# EAGLE design C64_Keyb-Test (EAGLE 9.5.2)
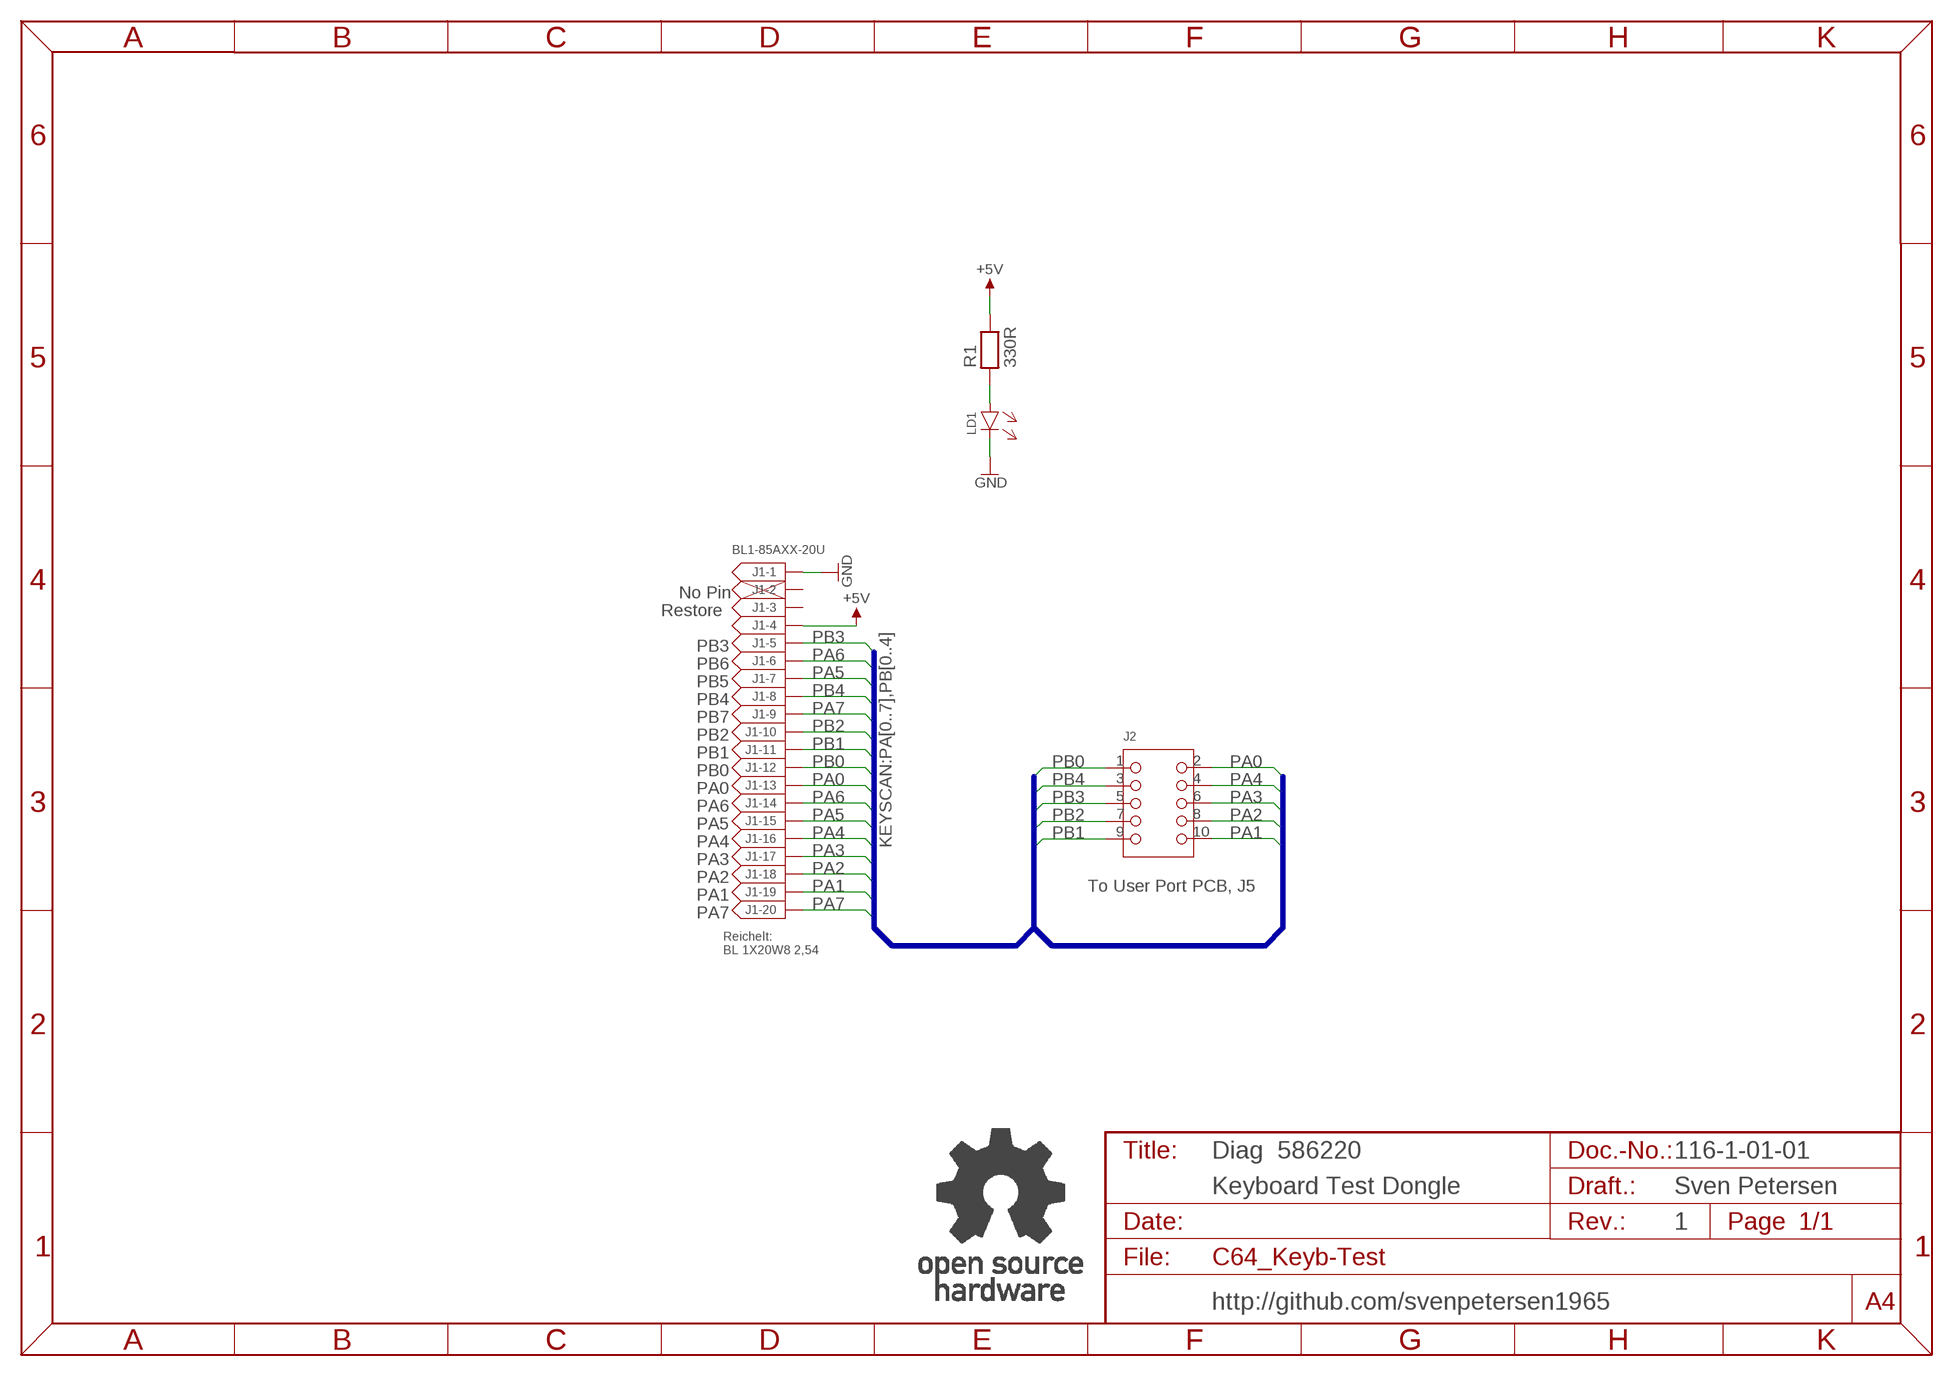
[diagram p0: schematic, sheet 1]

## Parts
J1  BL1-85AXX-20U  [BL1-85AXX-20U]
J2  2X05WV  [2X05WV]
LD1  3MM  [3MM]
R1  330R  RES04  [R-10]
U$9  OPEN_SOURCE_HW  [OPENHW]

## Nets
+5V: J1.4 R1.2
GND: J1.1 LD1.C(K)
N$1: LD1.A R1.1
PA0: J1.13 J2.2
PA1: J1.19 J2.10
PA2: J1.18 J2.8
PA3: J1.17 J2.6
PA4: J1.16 J2.4
PA5: J1.7 J1.15
PA6: J1.6 J1.14
PA7: J1.9 J1.20
PB0: J1.12 J2.1
PB1: J1.11 J2.9
PB2: J1.10 J2.7
PB3: J1.5 J2.5
PB4: J1.8 J2.3
Unconnected: J1.2 J1.3

## Buses
KEYSCAN:PA[0..7],PB[0..4]

## Notes on the sheet
- No Pin
- Restore
- PB3
- PB6
- PB5
- PB4
- PB7
- PB2
- PB1
- PB0
- PA0
- PA6
- PA5
- PA4
- PA3
- PA2
- To User Port PCB, J5
- PA1
- PA7
- Reichelt:
  BL 1X20W8 2,54
- Diag  586220 | 116-1-01-01
- Keyboard Test Dongle | Sven Petersen
- 1
- http://github.com/svenpetersen1965

## Library data of the parts
J1 = MPE_Garry:BL1-85AXX-20U
J2 = PINHEAD:2X05WV
LD1 = LED:3MM
R1 = DISCRETE:RES04
U$9 = Logo:OPEN_SOURCE_HW

## Board
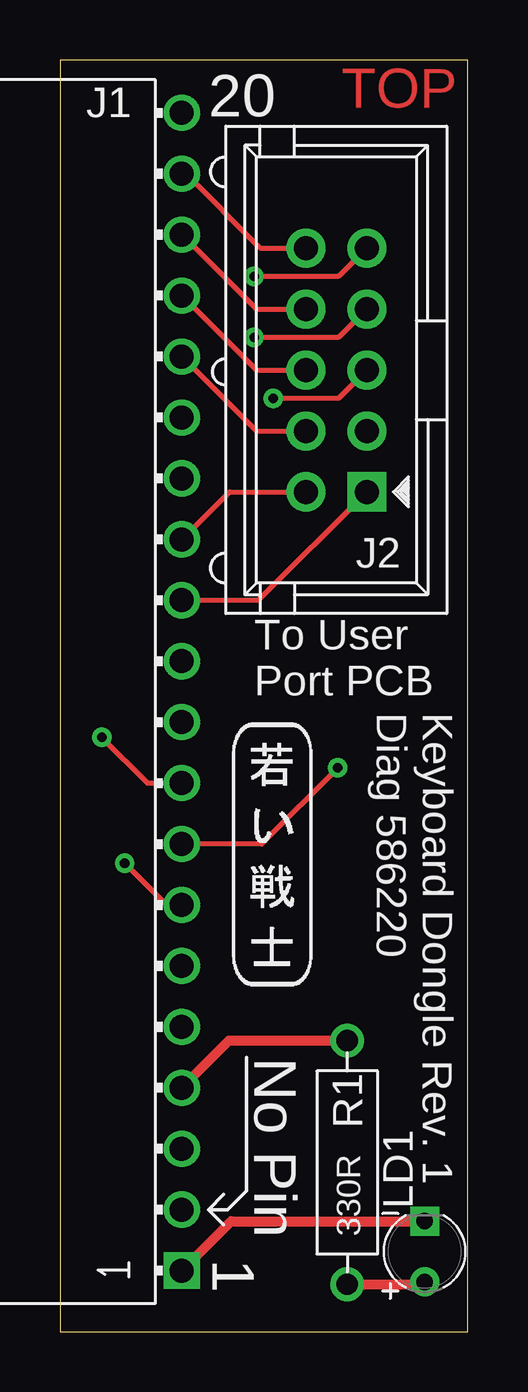
[diagram p1: board, top side]
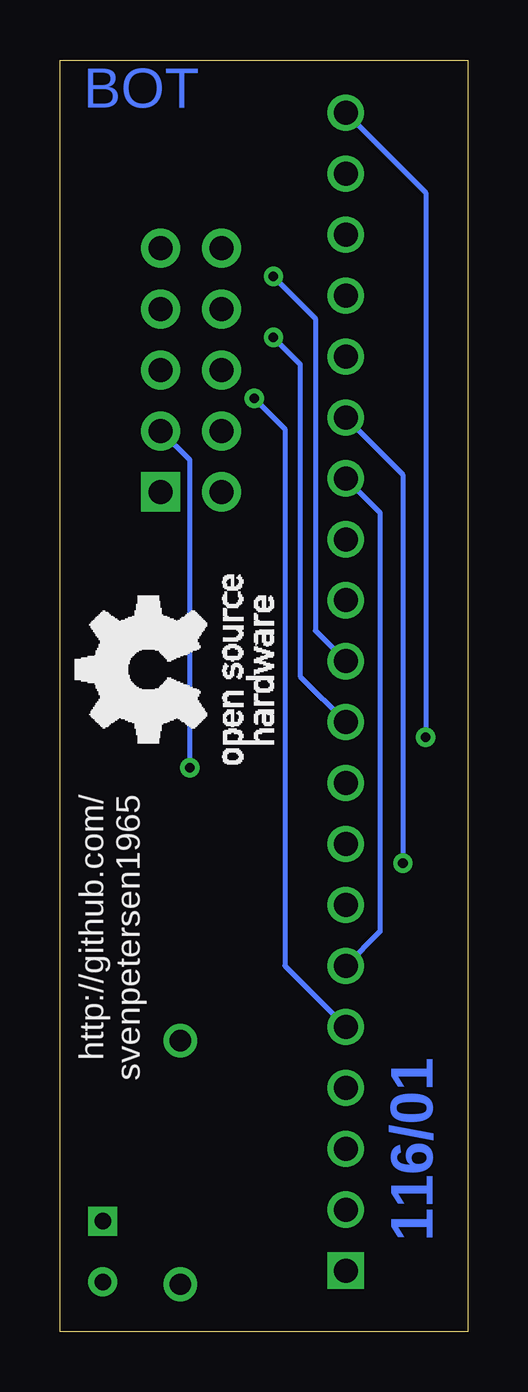
[diagram p2: board, bottom side, seen from below]

Size 17 x 53 mm. Coordinates in mm from the lower left corner, seen from the top.
Outline: 0,0 17,0 17,53 0,53 0,0
Copper layers (1*16): Top 0.035mm / dielectric 1.5mm / Bottom 0.035mm
Design rules "default *": minimum track width 6mil, minimum drill 0.35mm, track to track 6mil, track to pad 6mil, pad to pad 6mil, via to via 6mil, smd to smd 6mil, copper to edge 40mil, drill to drill 6mil, minimum pad ring 10mil, minimum via ring 8mil, stop-mask expansion 4mil, vias tented up to drill 24mil, thermal gap 10mil

### Footprints (pad centres in the part's own frame; a part is rotated, then mirrored left to right if it is on the bottom)
BL1-85AXX-20U = drill 1 square: 1 -24.13,0 | drill 1: 2 -21.59,0; 3 -19.05,0; 4 -16.51,0; 5 -13.97,0; 6 -11.43,0; 7 -8.89,0; 8 -6.35,0; 9 -3.81,0; 10 -1.27,0; 11 1.27,0; 12 3.81,0; 13 6.35,0; 14 8.89,0; 15 11.43,0; 16 13.97,0; 17 16.51,0; 18 19.05,0; 19 21.59,0; 20 24.13,0
2X05WV = drill 1 pad 1.626 square: 1 -5.08,-1.27 | drill 1 pad 1.626: 2 -5.08,1.27; 3 -2.54,-1.27; 4 -2.54,1.27; 5 0,-1.27; 6 0,1.27; 7 2.54,-1.27; 8 2.54,1.27; 9 5.08,-1.27; 10 5.08,1.27
3MM = drill 0.7: A -1.27,0 | drill 0.7 square: C 1.27,0
R-10 = drill 0.889 pad 1.397: 1 -5.08,0; 2 5.08,0

### Placement (x,y rotation side)
J1  5.08,26.67 90 top
J2  11.53,40.08 90 top
LD1  15.21,3.33 90 top
R1  11.98,7.05 90 top
U$6  [2LAYER]  11.73,51.01 0 top
U$7  [PCB-TITLE/]  0,60 0 top  (outside the outline)
U$8  [SVEN_TAG]  8.89,20 0 top
U$9  8.1,23.65 90 bottom

### Tracks (layer width: path | path; a pad name or v marks a point on that pad's centre or on a via)
+5V
  Top 0.406: J1.4 7.05,12.13 R1.2
GND
  Top 0.406: J1.1 7.14,4.6 LD1.C
N$1
  Top 0.406: R1.1 15.11,1.97 LD1.A
PA0
  Top 0.203: J1.13 5.1,33.02 7.08,35 J2.2
PA1
  Top 0.203: J1.19 5.25,48.26 8.35,45.16 J2.10
PA2
  Top 0.203: J1.18 8.19,42.62 J2.8
PA3
  Top 0.203: J1.17 8.19,40.08 J2.6
PA4
  Top 0.203: J1.16 8.19,37.54 J2.4
PA5  (via drill 0.4)
  Top 0.203: v2.7,19.53 4.45,17.78 J1.7
  Bottom 0.203: J1.15 2.7,35.72 v2.7,19.53
PA6
  Bottom 0.203: J1.14 3.65,34.13 3.65,16.67 J1.6
PA7  (via drill 0.4)
  Top 0.203: v1.75,24.77 3.65,22.86 J1.9
  Bottom 0.203: J1.20 1.75,47.47 v1.75,24.77
PB0
  Top 0.203: J1.12 8.28,30.48 J2.1
PB1  (via drill 0.4)
  Top 0.203: J2.9 11.61,43.97 v8.1,43.97
  Bottom 0.203: v8.1,43.97 6.35,42.23 6.35,29.21 J1.11
PB2  (via drill 0.4)
  Top 0.203: J2.7 11.61,41.43 v8.1,41.43
  Bottom 0.203: v8.1,41.43 6.99,40.32 6.99,27.3 J1.10
PB3  (via drill 0.4)
  Top 0.203: J2.5 11.61,38.89 v8.89,38.89
  Bottom 0.203: v8.89,38.89 7.62,37.62 7.62,15.24 J1.5
PB4  (via drill 0.4)
  Top 0.203: v11.59,23.5 8.41,20.32 J1.8
  Bottom 0.203: J2.3 11.59,36.33 v11.59,23.5

### Text on the board
Bottom: 116/01
tPlace: 20 | To User / Port PCB | Keyboard Dongle Rev. 1 / Diag 586220 | No Pin | 1
bPlace: http://github.com/ / svenpetersen1965
tNames: 330R
Document: 116-2-01-01 | Sven Petersen / 2019 | 35µm | 2 | 1